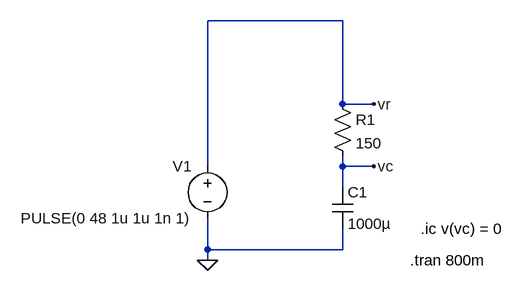
[diagram p0: schematic inrush.asc]
inrush.asc, the LTspice schematic file:
Version 4
SHEET 1 880 680
WIRE 160 -48 -48 -48
WIRE 160 80 160 -48
WIRE 208 80 160 80
WIRE -48 176 -48 -48
WIRE 160 176 160 160
WIRE 208 176 160 176
WIRE 160 208 160 176
WIRE -48 304 -48 256
WIRE 160 304 160 272
WIRE 160 304 -48 304
WIRE -48 320 -48 304
FLAG -48 320 0
FLAG 208 176 vc
FLAG 208 80 vr
SYMBOL voltage -48 160 M0
WINDOW 123 0 0 Left 2
WINDOW 39 0 0 Left 2
SYMATTR InstName V1
SYMATTR Value PULSE(0 48 1u 1u 1n 1)
SYMBOL res 144 64 R0
SYMATTR InstName R1
SYMATTR Value 150
SYMBOL cap 144 208 R0
SYMATTR InstName C1
SYMATTR Value 1000µ
TEXT 264 320 Left 2 !.tran 800m
TEXT 280 272 Left 2 !.ic v(vc) = 0

The netlist it stands for:
* inrush.asc
V1 vr 0 PULSE(0 48 1u 1u 1n 1)
R1 vr vc 150
C1 vc 0 1000µ
.tran 800m
.ic v(vc) = 0
.backanno
.end